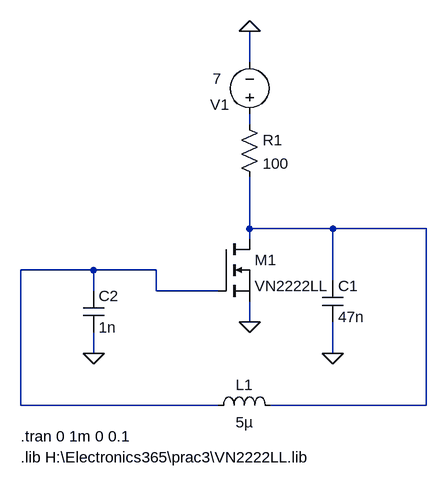
[diagram p0: schematic Draft7.asc]
Draft7.asc, the LTspice schematic file:
Version 4
SHEET 1 880 680
WIRE 48 -336 48 -384
WIRE 48 -240 48 -256
WIRE 48 -80 48 -160
WIRE 176 -80 48 -80
WIRE 320 -80 176 -80
WIRE 48 -64 48 -80
WIRE -192 -16 -304 -16
WIRE -96 -16 -192 -16
WIRE 176 0 176 -80
WIRE -192 16 -192 -16
WIRE -96 16 -96 -16
WIRE 0 16 -96 16
WIRE 48 64 48 32
WIRE -192 112 -192 80
WIRE 176 112 176 64
WIRE -304 192 -304 -16
WIRE 0 192 -304 192
WIRE 320 192 320 -80
WIRE 320 192 80 192
FLAG -192 112 0
FLAG 176 112 0
FLAG 48 -384 0
FLAG 48 64 0
SYMBOL res 32 -256 R0
SYMATTR InstName R1
SYMATTR Value 100
SYMBOL ind -16 208 R270
WINDOW 0 32 56 VTop 2
WINDOW 3 5 56 VBottom 2
SYMATTR InstName L1
SYMATTR Value 5µ
SYMBOL cap 160 0 R0
SYMATTR InstName C1
SYMATTR Value 47n
SYMBOL cap -208 16 R0
SYMATTR InstName C2
SYMATTR Value 1n
SYMBOL voltage 48 -240 R180
WINDOW 0 31 31 Left 2
WINDOW 3 43 71 Left 2
WINDOW 123 0 0 Left 0
WINDOW 39 0 0 Left 0
SYMATTR InstName V1
SYMATTR Value 7
SYMBOL nmos 0 -64 R0
SYMATTR InstName M1
SYMATTR Value VN2222LL
TEXT -304 240 Left 2 !.tran 0 1m 0 0.1
TEXT -304 272 Left 2 !.lib H:\\Electronics365\\prac3\\VN2222LL.lib

The netlist it stands for:
* Draft7.asc
R1 N001 N002 100
L1 N003 N002 5µ
C1 N002 0 47n
C2 N003 0 1n
V1 N001 0 7
M1 N002 N003 0 0 VN2222LL
.model NMOS NMOS
.model PMOS PMOS
.lib standard.mos
.tran 0 1m 0 0.1
.lib H:\Electronics365\prac3\VN2222LL.lib
.backanno
.end